# Altium project GIRO_LOGGER.PrjPcb
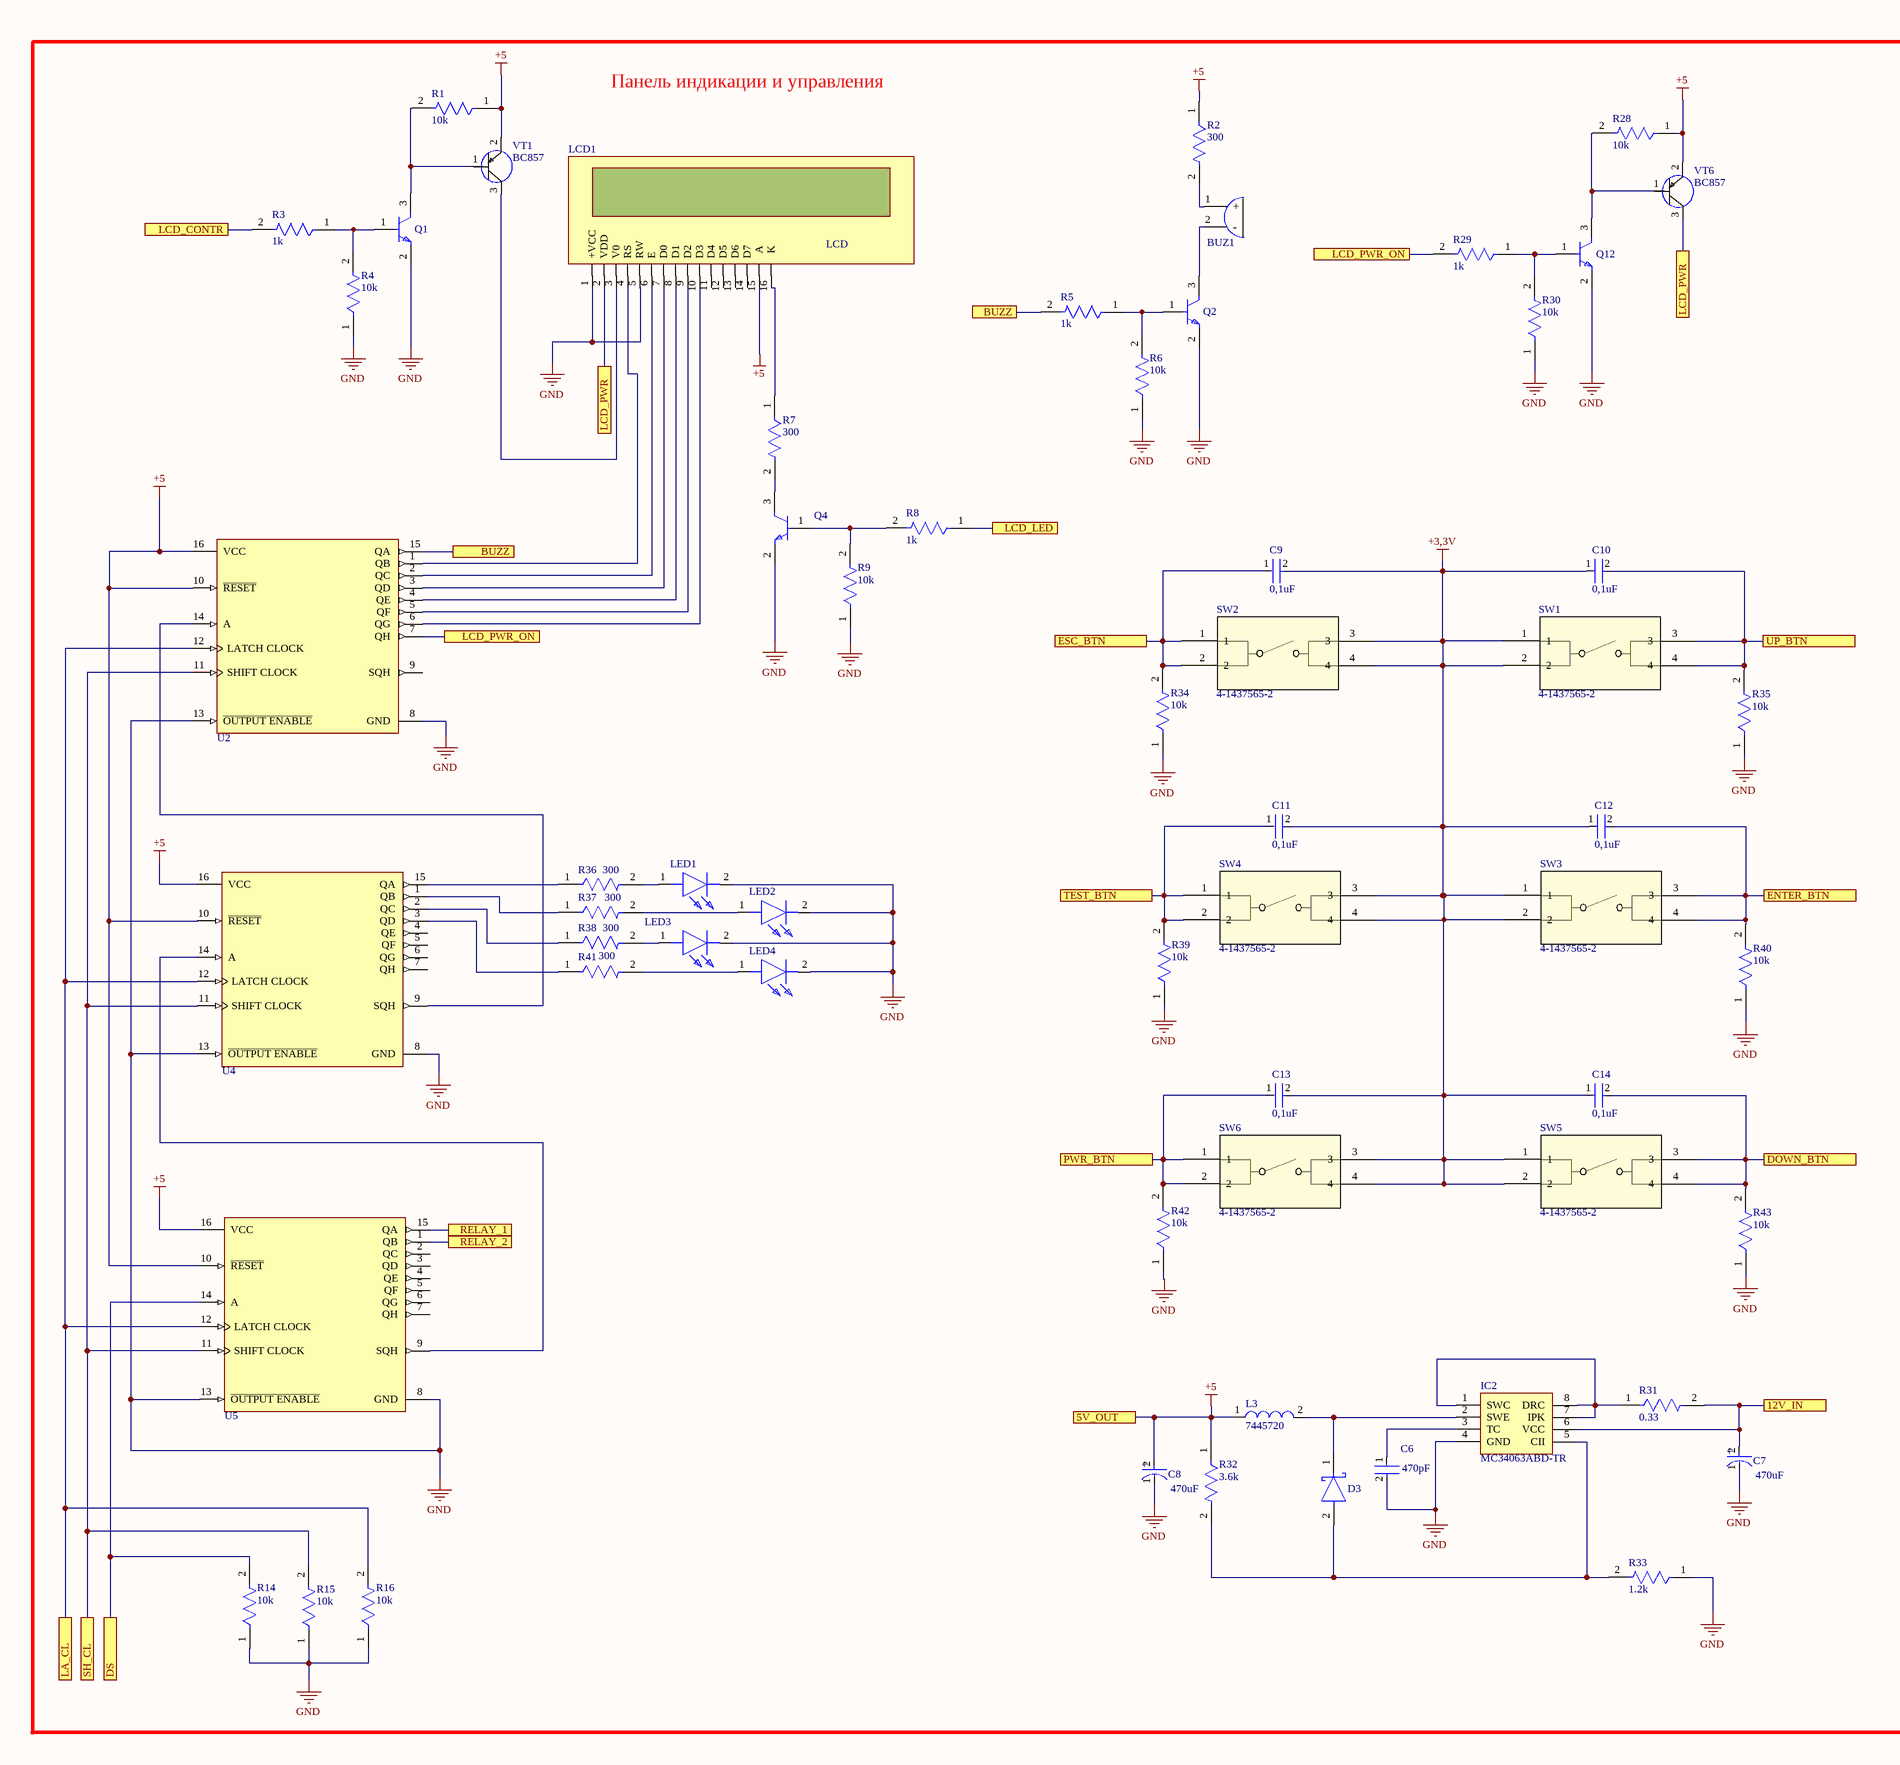
[diagram p0: Logger.SchDoc, left]
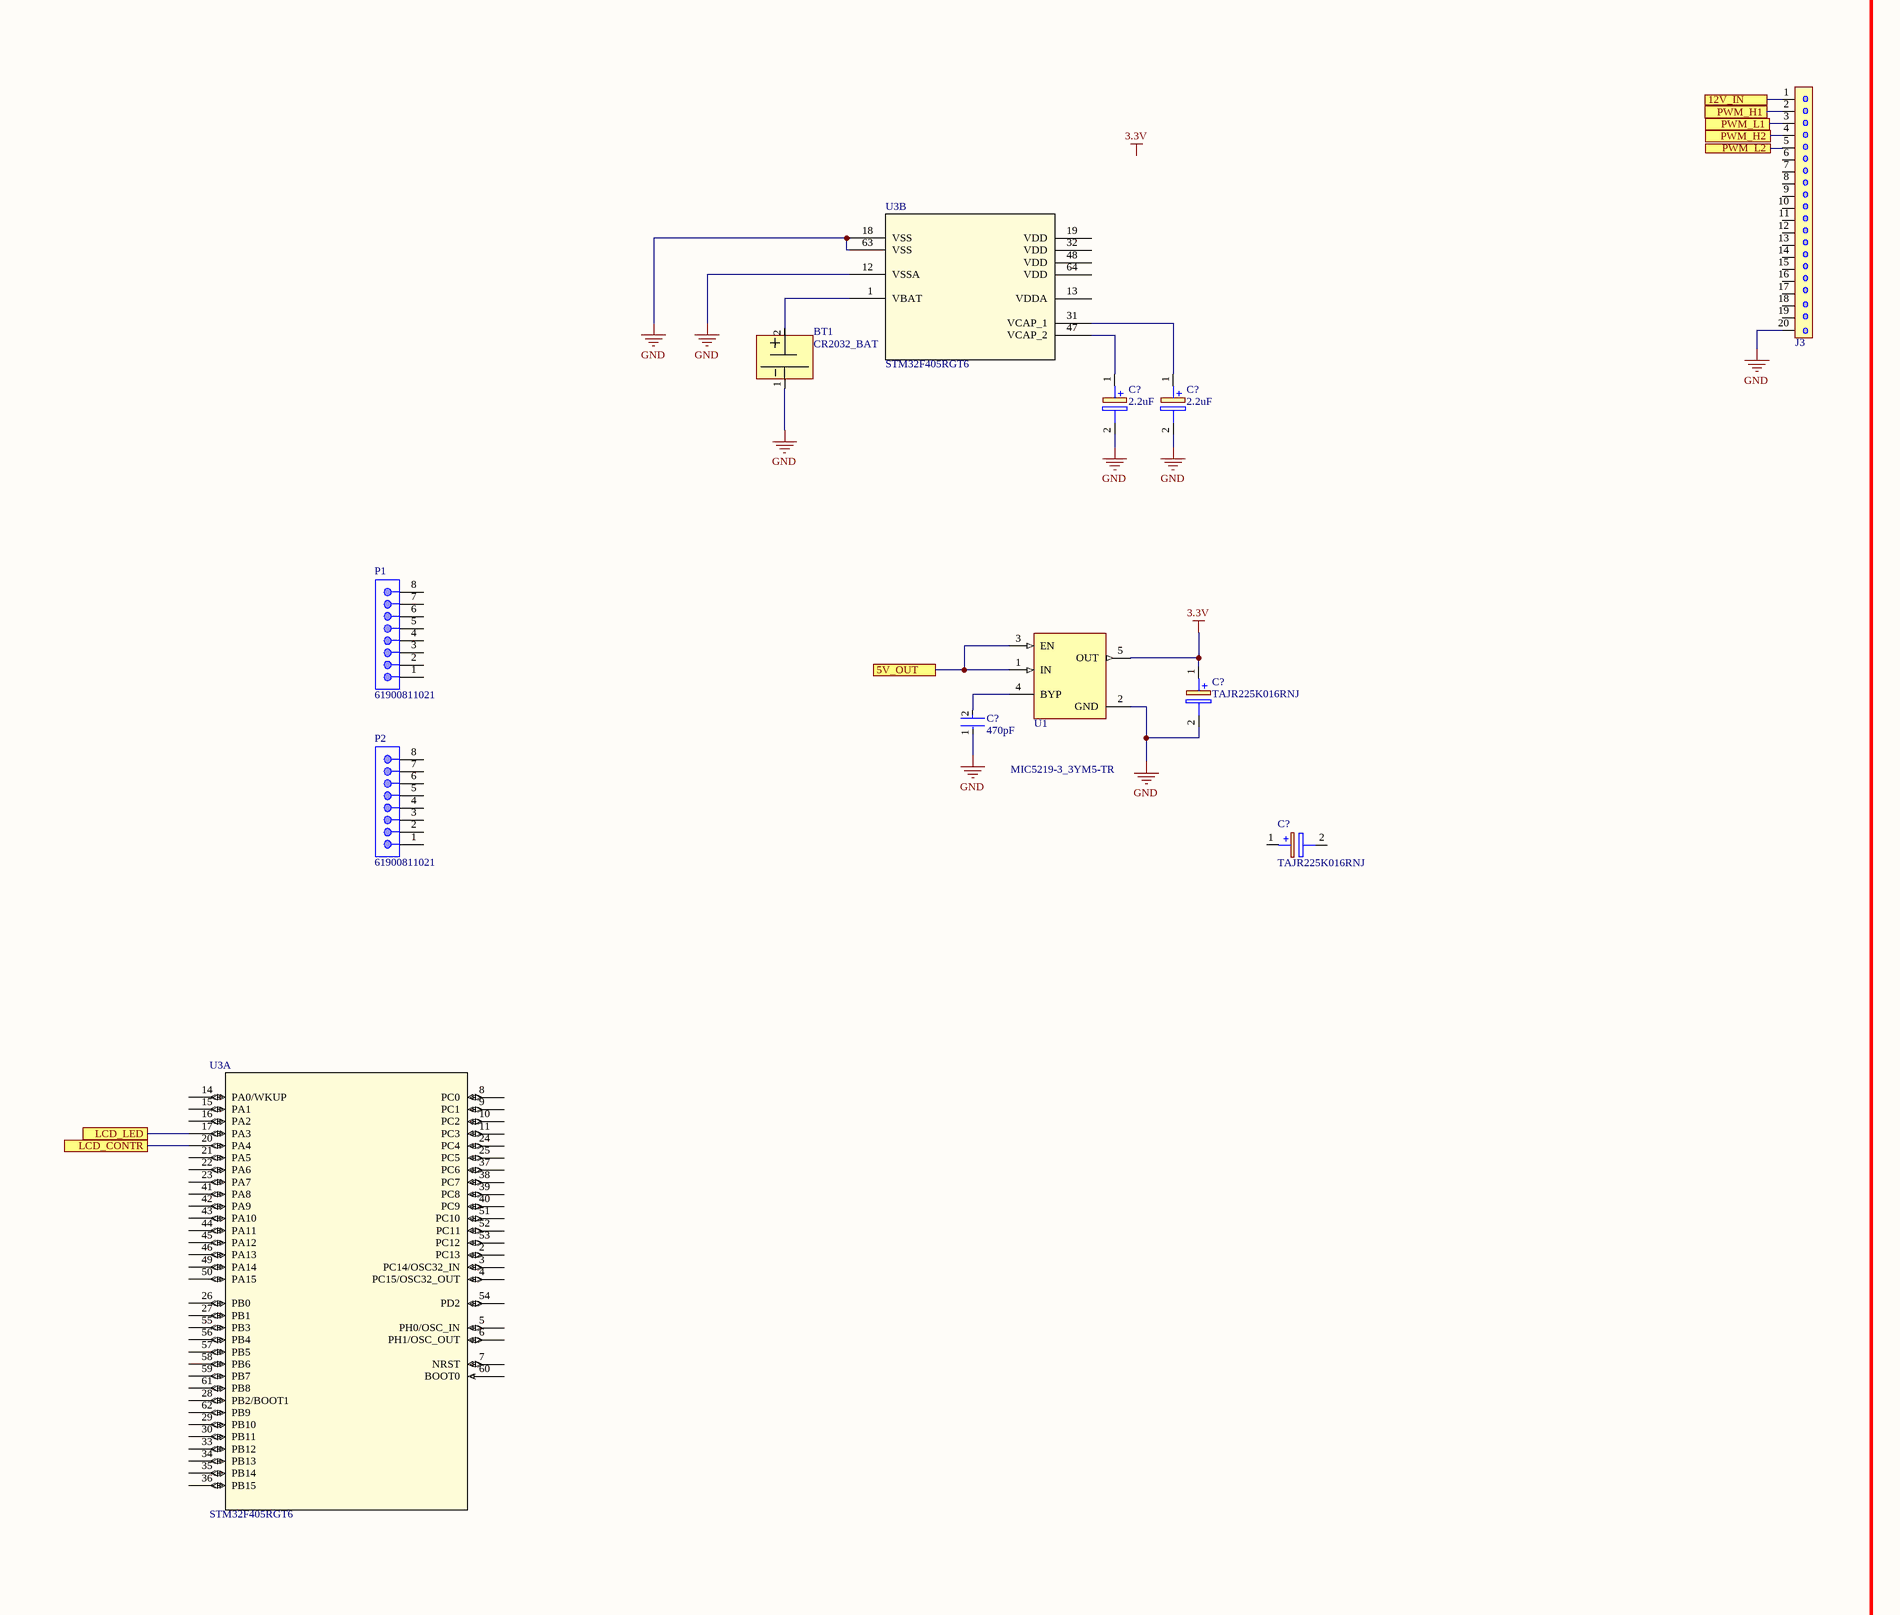
[diagram p1: Logger.SchDoc, right]
4 sheets, 246 parts. Net scope: flat (ports and power ports of the same name join across sheets).
Board files: PCB1.PcbDoc, INVERTER.PcbDoc, Batarey.PcbDoc
Sheets:
  Logger.SchDoc
  Sheet1.SchDoc
  Batarey.SchDoc
  INV.SchDoc

## Sheet Logger.SchDoc
size A1; SheetNumber: 1; SheetTotal: 4

### Parts
(Parts that share a designator on the sheet are numbered #1, #2 ... from top to bottom, then left to right.)
BT1  CR2032_BAT  [CR2032_BAT]
BUZ1  BUZZER  [BUZZER]  (value not drawn)
C6  470pF  [KEMET_C0805C-DN_IPC_C]
C7  470uF  [Nichicon_0_MFG]
C8  470uF  [Nichicon_0_MFG]
C9  0,1uF  [KEMET_C0805C-DN_IPC_C]
C10  0,1uF  [KEMET_C0805C-DN_IPC_C]
C11  0,1uF  [KEMET_C0805C-DN_IPC_C]
C12  0,1uF  [KEMET_C0805C-DN_IPC_C]
C13  0,1uF  [KEMET_C0805C-DN_IPC_C]
C14  0,1uF  [KEMET_C0805C-DN_IPC_C]
C?#1  2.2uF  [CAPPM2014X140N]
C?#2  2.2uF  [CAPPM2014X140N]
C?#3  TAJR225K016RNJ  [CAPPM2014X140N]
C?#4  470pF  [KEMET_C0805C-DN_IPC_C]
C?#5  TAJR225K016RNJ  [CAPPM2014X140N]
D3  Diode_Vishay_SS16-E3-61T_eec  [Vishay_SS16-E3-61T_0]  (value not drawn)
IC2  MC34063ABD-TR  [SOIC127P600X175-8N]
J3  20_pin_connector  [20_pin_connector]  (value not drawn)
L3  7445720  [WE-PD2-L]
LCD1  LCD  [LCD20x4]
LED1  151031YS06000  [151031YS06000]  (value not drawn)
LED2  151031YS06000  [151031YS06000]  (value not drawn)
LED3  151031YS06000  [151031YS06000]  (value not drawn)
LED4  151031YS06000  [151031YS06000]  (value not drawn)
P1  61900811021  [61900811021]
P2  61900811021  [61900811021]
Q1  SBC847BLT1G  [On_Semiconductor_318-08_IPC_B]  (value not drawn)
Q2  SBC847BLT1G  [On_Semiconductor_318-08_IPC_B]  (value not drawn)
Q4  SBC847BLT1G  [On_Semiconductor_318-08_IPC_B]  (value not drawn)
Q12  SBC847BLT1G  [On_Semiconductor_318-08_IPC_B]  (value not drawn)
R1  10k  [Vishay_CRCW0805-e3_IPC_A]
R2  300  [Vishay_CRCW0805-e3_IPC_A]
R3  1k  [Vishay_CRCW0805-e3_IPC_A]
R4  10k  [Vishay_CRCW0805-e3_IPC_A]
R5  1k  [Vishay_CRCW0805-e3_IPC_A]
R6  10k  [Vishay_CRCW0805-e3_IPC_A]
R7  300  [Vishay_CRCW0805-e3_IPC_A]
R8  1k  [Vishay_CRCW0805-e3_IPC_A]
R9  10k  [Vishay_CRCW0805-e3_IPC_A]
R14  10k  [Vishay_CRCW0805-e3_IPC_A]
R15  10k  [Vishay_CRCW0805-e3_IPC_A]
R16  10k  [Vishay_CRCW0805-e3_IPC_A]
R28  10k  [Vishay_CRCW0805-e3_IPC_A]
R29  1k  [Vishay_CRCW0805-e3_IPC_A]
R30  10k  [Vishay_CRCW0805-e3_IPC_A]
R31  0.33  [Vishay_CRCW0805-e3_IPC_A]
R32  3.6k  [Vishay_CRCW0805-e3_IPC_A]
R33  1.2k  [Vishay_CRCW0805-e3_IPC_A]
R34  10k  [Vishay_CRCW0805-e3_IPC_A]
R35  10k  [Vishay_CRCW0805-e3_IPC_A]
R36  300  [Vishay_CRCW0805-e3_IPC_A]
R37  300  [Vishay_CRCW0805-e3_IPC_A]
R38  300  [Vishay_CRCW0805-e3_IPC_A]
R39  10k  [Vishay_CRCW0805-e3_IPC_A]
R40  10k  [Vishay_CRCW0805-e3_IPC_A]
R41  300  [Vishay_CRCW0805-e3_IPC_A]
R42  10k  [Vishay_CRCW0805-e3_IPC_A]
R43  10k  [Vishay_CRCW0805-e3_IPC_A]
SW1  4-1437565-2  [SW4_FSM-5P23_TEC]
SW2  4-1437565-2  [SW4_FSM-5P23_TEC]
SW3  4-1437565-2  [SW4_FSM-5P23_TEC]
SW4  4-1437565-2  [SW4_FSM-5P23_TEC]
SW5  4-1437565-2  [SW4_FSM-5P23_TEC]
SW6  4-1437565-2  [SW4_FSM-5P23_TEC]
U1  MIC5219-3_3YM5-TR  [Microchip_SOT23-5LD-PL-1_MFG]
U2  MC74HC595ADG  [On_Semiconductor_751B-05_MFG]  (value not drawn)
U3  STM32F405RGT6  [LQFP64-10x10mm]  (parts A,B of 2)
U4  MC74HC595ADG  [On_Semiconductor_751B-05_IPC_B]  (value not drawn)
U5  MC74HC595ADG  [On_Semiconductor_751B-05_IPC_B]  (value not drawn)
VT1  BC857  [On_Semiconductor_318-08_IPC_C]
VT6  BC857  [On_Semiconductor_318-08_IPC_C]

### Blocks framed on the sheet
Панель индикации и управления: BT1 BUZ1 C6-C14 C?#1-C?#5 D3 IC2 J3 L3 LCD1 LED1-LED4 P1 P2 Q1 Q2 Q4 Q12 R1-R9 R14-R16 R28-R43 SW1-SW6 U1-U5 VT1 VT6

### Ports
5V_OUT, 12V_IN, BUZZ, DOWN_BTN, DS, ENTER_BTN, ESC_BTN, LA_CL, LCD_CONTR, LCD_LED, LCD_PWR, LCD_PWR_ON, PWM_H1, PWM_H2, PWM_L1, PWM_L2, PWR_BTN, RELAY_1, RELAY_2, SH_CL, TEST_BTN, UP_BTN

### Nets
3.3V: C?#3.1(+) U1.5(OUT)
+3,3V: C9.2 C10.1 C11.2 C12.1 C13.2 C14.1 SW1.1 SW1.2 SW2.3 SW2.4 SW3.1 SW3.2 SW4.3 SW4.4 SW5.1 SW5.2 SW6.3 SW6.4
+5: C8.2(A) L3.1 LCD1.15(A) R1.1 R2.1 R28.1 R32.1 U1.1(IN) U1.3(EN) U2.10(~{RESET}) U2.16(VCC) U4.10(~{RESET}) U4.16(VCC) U5.10(~{RESET}) U5.16(VCC) VT1.2(E) VT6.2(E) ; port 5V_OUT
GND: BT1.1(-) C6.2 C7.1(C) C8.1(C) C?#1.2(-) C?#2.2(-) C?#3.2(-) C?#4.1 IC2.4(GND) J3.20 LCD1.1(+VCC) LCD1.5(RW) LED1.2(K) LED2.2(K) LED3.2(K) LED4.2(K) Q1.2(E) Q2.2(E) Q4.2(E) Q12.2(E) R4.1 R6.1 R9.1 R14.1 R15.1 R16.1 R30.1 R33.1 R34.1 R35.1 R39.1 R40.1 R42.1 R43.1 U1.2(GND) U2.8(GND) U2.13(~{OUTPUT_ENABLE}) U3.12(VSSA) U3.18(VSS) U3.63(VSS) U4.8(GND) U4.13(~{OUTPUT_ENABLE}) U5.8(GND) U5.13(~{OUTPUT_ENABLE})
NetBT1_2: BT1.2(+) U3.1(VBAT)
NetBUZ1_1: BUZ1.1(+) R2.2
NetBUZ1_2: BUZ1.2(-) Q2.3(C)
NetC6_1: C6.1 IC2.3(TC)
NetC7_2: C7.2(A) IC2.6(VCC) J3.1 R31.2 ; port 12V_IN
NetC9_1: C9.1 R34.2 SW2.1 SW2.2 ; port ESC_BTN
NetC10_2: C10.2 R35.2 SW1.3 SW1.4 ; port UP_BTN
NetC11_1: C11.1 R39.2 SW4.1 SW4.2 ; port TEST_BTN
NetC12_2: C12.2 R40.2 SW3.3 SW3.4 ; port ENTER_BTN
NetC13_1: C13.1 R42.2 SW6.1 SW6.2 ; port PWR_BTN
NetC14_2: C14.2 R43.2 SW5.3 SW5.4 ; port DOWN_BTN
NetC?#1_1: C?#1.1(+) U3.47(VCAP_2)
NetC?#2_1: C?#2.1(+) U3.31(VCAP_1)
NetC?#4_2: C?#4.2 U1.4(BYP)
NetD3_1: D3.1(C) IC2.2(SWE) L3.2
NetD3_2: D3.2(A) IC2.5(CII) R32.2 R33.2
NetIC2_1: IC2.1(SWC) IC2.7(IPK) IC2.8(DRC) R31.1
NetJ3_2: J3.2 ; port PWM_H1
NetJ3_3: J3.3 ; port PWM_L1
NetJ3_4: J3.4 ; port PWM_H2
NetJ3_5: J3.5 ; port PWM_L2
NetLCD1_2: LCD1.2(VDD) VT6.3(C) ; port LCD_PWR
NetLCD1_3: LCD1.3(V0) VT1.3(C)
NetLCD1_4: LCD1.4(RS) U2.1(QB)
NetLCD1_6: LCD1.6(E) U2.2(QC)
NetLCD1_7: LCD1.7(D0) U2.3(QD)
NetLCD1_8: LCD1.8(D1) U2.4(QE)
NetLCD1_9: LCD1.9(D2) U2.5(QF)
NetLCD1_10: LCD1.10(D3) U2.6(QG)
NetLCD1_16: LCD1.16(K) R7.1
NetLED1_1: LED1.1(A) R36.2
NetLED2_1: LED2.1(A) R37.2
NetLED3_1: LED3.1(A) R38.2
NetLED4_1: LED4.1(A) R41.2
NetQ1_1: Q1.1(B) R3.1 R4.2
NetQ1_3: Q1.3(C) R1.2 VT1.1(B)
NetQ2_1: Q2.1(B) R5.1 R6.2
NetQ4_1: Q4.1(B) R8.2 R9.2
NetQ4_3: Q4.3(C) R7.2
NetQ12_1: Q12.1(B) R29.1 R30.2
NetQ12_3: Q12.3(C) R28.2 VT6.1(B)
NetR3_2: R3.2 U3.20(PA4) ; port LCD_CONTR
NetR5_2: R5.2 U2.15(QA) ; port BUZZ
NetR8_1: R8.1 U3.17(PA3) ; port LCD_LED
NetR14_2: R14.2 U5.14(A) ; port DS
NetR15_2: R15.2 U2.11(SHIFT_CLOCK) U4.11(SHIFT_CLOCK) U5.11(SHIFT_CLOCK) ; port SH_CL
NetR16_2: R16.2 U2.12(LATCH_CLOCK) U4.12(LATCH_CLOCK) U5.12(LATCH_CLOCK) ; port LA_CL
NetR29_2: R29.2 U2.7(QH) ; port LCD_PWR_ON
NetR36_1: R36.1 U4.15(QA)
NetR37_1: R37.1 U4.1(QB)
NetR38_1: R38.1 U4.2(QC)
NetR41_1: R41.1 U4.3(QD)
NetU2_14: U2.14(A) U4.9(SQH)
NetU4_14: U4.14(A) U5.9(SQH)
NetU5_1: U5.1(QB) ; port RELAY_2
NetU5_15: U5.15(QA) ; port RELAY_1

Not connected (* = marked no-connect by the designer): C?#5 1(+) 2(-); J3 6 7 8 9 10 11 12 13 14 15 16 17 18 19; LCD1 11(D4) 12(D5) 13(D6) 14(D7); P1 1 2 3 4 5 6 7 8; P2 1 2 3 4 5 6 7 8; U2 9(SQH); U3 2(PC13) 3(PC14/OSC32_IN) 4(PC15/OSC32_OUT) 5(PH0/OSC_IN) 6(PH1/OSC_OUT) 7(NRST) 8(PC0) 9(PC1) 10(PC2) 11(PC3) 13(VDDA) 14(PA0/WKUP) 15(PA1) 16(PA2) 19(VDD) 21(PA5) 22(PA6) 23(PA7) 24(PC4) 25(PC5) 26(PB0) 27(PB1) 28(PB2/BOOT1) 29(PB10) 30(PB11) 32(VDD) 33(PB12) 34(PB13) 35(PB14) 36(PB15) 37(PC6) 38(PC7) 39(PC8) 40(PC9) 41(PA8) 42(PA9) 43(PA10) 44(PA11) 45(PA12) 46(PA13) 48(VDD) 49(PA14) 50(PA15) 51(PC10) 52(PC11) 53(PC12) 54(PD2) 55(PB3) 56(PB4) 57(PB5) 58(PB6) 59(PB7) 60(BOOT0) 61(PB8) 62(PB9) 64(VDD); U4 4(QE) 5(QF) 6(QG) 7(QH); U5 2(QC) 3(QD) 4(QE) 5(QF) 6(QG) 7(QH)

### Notes on the sheet
- Labels drawn without touching a wire or pin: 3.3V
- (in symbol UWX1E101MCL1GB) +

### Library data of the parts
C6 C9-C14 C?#4 = C0805C104J4RACTU
C7 C8 = UWX1E101MCL1GB
C?#1-C?#3 C?#5 = TAJR225K016RNJ: Capacitor Polarised; Manufacturer_Name: AVX; Datasheet Link: http://www.farnell.com/datasheets/1680476.pdf; Height: 1.2mm; Manufacturer_Part_Number: TAJR225K016RNJ; Mouser Part Number: 581-TAJR225K016RNJ; Mouser Price/Stock: https://www.mouser.co.uk/ProductDetail/AVX/TAJR225K016RNJ/?qs=vQJa%252BfcOt8MJtnsQ1zkKAg%3D%3D; Arrow Part Number: TAJR225K016RNJ; Arrow Price/Stock: https://www.arrow.com/en/products/tajr225k016rnj/avx
D3 = Diode_Vishay_SS16-E3-61T_eec: Diode Schottky 60V 1A Surface Mount DO-214AC (SMA); Part Number: SS16-E3/61T; Manufacturer: Vishay; Voltage - Forward (Vf) (Max) @ If: 750mV @ 1A; Current - Reverse Leakage @ Vr: 200µA @ 60V; helpURL: https://upverter.com/upn/revision/46fb9ccadf7e3052/; ComponentLink2Description: Datasheet; Temperature: -65°C to +150°C; Package: DO-214AC; Supplier 2: Mouser; Price: 0.180579591464; Supplier 1: Digi-Key; ComponentLink1URL: https://upverter.com/upn/revision/46fb9ccadf7e3052/; Supplier Part Number 2: 625-SS16-E3; Supplier Part Number 1: SS16-E3/61TGICT-ND; ComponentLink1Description: Upverter; ComponentLink2URL: http://www.vishay.com/docs/88746/ss12.pdf; RoHS: TRUE; Mouser Part Number: 625-SS16-E3; Temperature Range High: +150°C; Digikey Description: Diode Schottky 60V 1A Surface Mount DO-214AC (SMA); Digikey Part Number: SS16-E3/61TGICT-ND; Current - Average Rectified (Io): 1A; Lead Free: yes; Voltage - DC Reverse (Vr) (Max): 60V; Temperature Range Low: -65°C
IC2 = MC34063ABD-TR: Integrated Circuit; Manufacturer_Name: STMicroelectronics; Datasheet Link: http://www.st.com/st-web-ui/static/active/en/resource/technical/document/datasheet/CD00001232.pdf; Height: 1.75mm; Manufacturer_Part_Number: MC34063ABD-TR; Mouser Part Number: 511-MC34063ABD-TR; Mouser Price/Stock: https://www.mouser.co.uk/ProductDetail/STMicroelectronics/MC34063ABD-TR?qs=PGXP4M47uW4YbbaNPuFQGA%3D%3D; Arrow Part Number: MC34063ABD-TR; Arrow Price/Stock: https://www.arrow.com/en/products/mc34063abd-tr/stmicroelectronics?region=nac
J3 = 20_pin_connector: 20_pin 2.54mm connector
L3 = 7445720: SMD-Power Inductor WE-PD4, L = 100 µH; Inductance: 100 ÂµH; ComponentLink1Description: Manufacturer Link; ComponentLink2Description: Datasheet; DatasheetVersion: ver 1, Oct-2004; ComponentLink1URL: http://www.we-online.com; PackageVersion: 2004; PackageDescription: SMD Inductor, 2-Leads, Body 22.0 x 15.0 mm; ComponentLink2URL: http://www.we-online.de/katalog/media/pdf/7445720.pdf; PackageReference: WE-PD4-XL; PartNumber: 7445720
LCD1 = LCD: 20x4
LED1-LED4 = 151031YS06000: LED; Manufacturer_Name: Wurth Elektronik; Datasheet Link: https://katalog.we-online.de/led/datasheet/151031YS06000.pdf; Height: 5.5mm; Manufacturer_Part_Number: 151031YS06000; Mouser Part Number: 710-151031YS06000; Mouser Price/Stock: https://www.mouser.co.uk/ProductDetail/Wurth-Elektronik/151031YS06000?qs=LlUlMxKIyB3xSYYW%252BcuBiQ%3D%3D
P1 P2 = 61900811021: WR-WTB THT Male Left Angled Bottom Locking Header, pitch 2.54mm, 8p; Pin Number: 8; Contact Resistance: 20mOhm; Rated Current: 3A; Withstanding Voltage: 1000VAC; Working Voltage: 250VAC; ComponentLink1Description: Manufacturer; ComponentLink1URL: http://www.we-online.de; ComponentLink2Description: Datasheet; ComponentLink2URL: https://www.we-online.com/catalog/datasheet/61900811021.pdf; Pitch: 2.54mm; Published Date: January 2020; Publisher: Wurth Elektronik; Mounting Technology: THT; Packaging: Bag; Operating Temperature: -40 to +105degC; Part Number: 61900811021; Gender: Male; Type: Right Angled Bottom Locking
R1-R9 R14-R16 R28-R43 = CRCW08050000Z0EA: 100k: *
SW1-SW6 = 4-1437565-2: No Description Available; Mfr_Name: TE Connectivity; Copyright: Copyright (C) 2022 Ultra Librarian. All rights reserved.; Manufacturer_Part_Number: 4-1437565-2; RefDes: RefDes; Type: DEV
U3 = STM32F405RGT6: No Description Available; Mfr_Name: STMicroelectronics; Copyright: Copyright (C) 2022 Ultra Librarian. All rights reserved.; Manufacturer_Part_Number: STM32F405RGT6; RefDes: RefDes; Type: DEV

## Sheet Sheet1.SchDoc
size A0; SheetNumber: 3; SheetTotal: 4
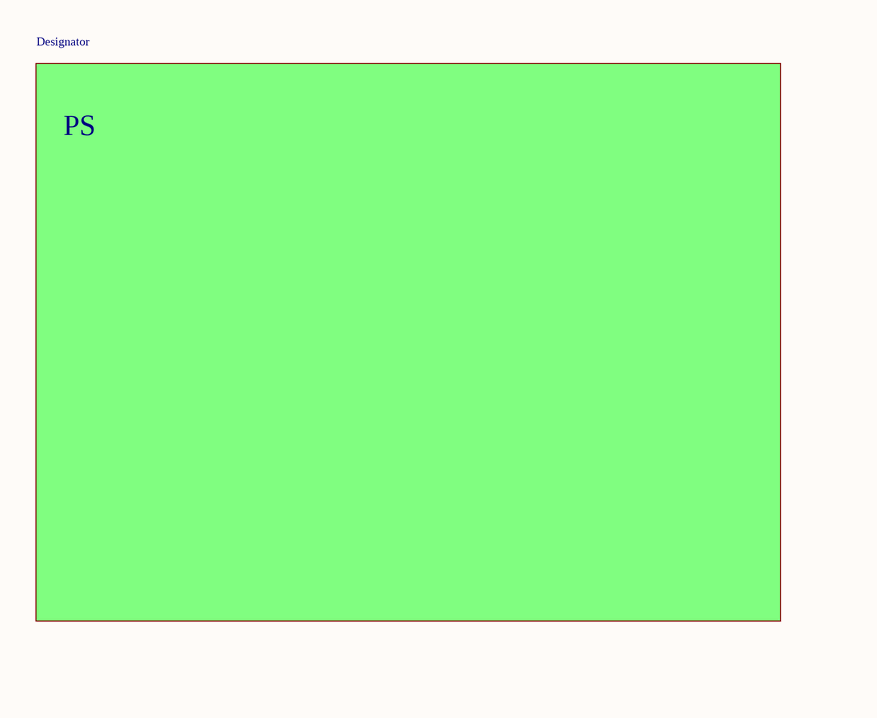
[diagram p2: Sheet1.SchDoc, left]
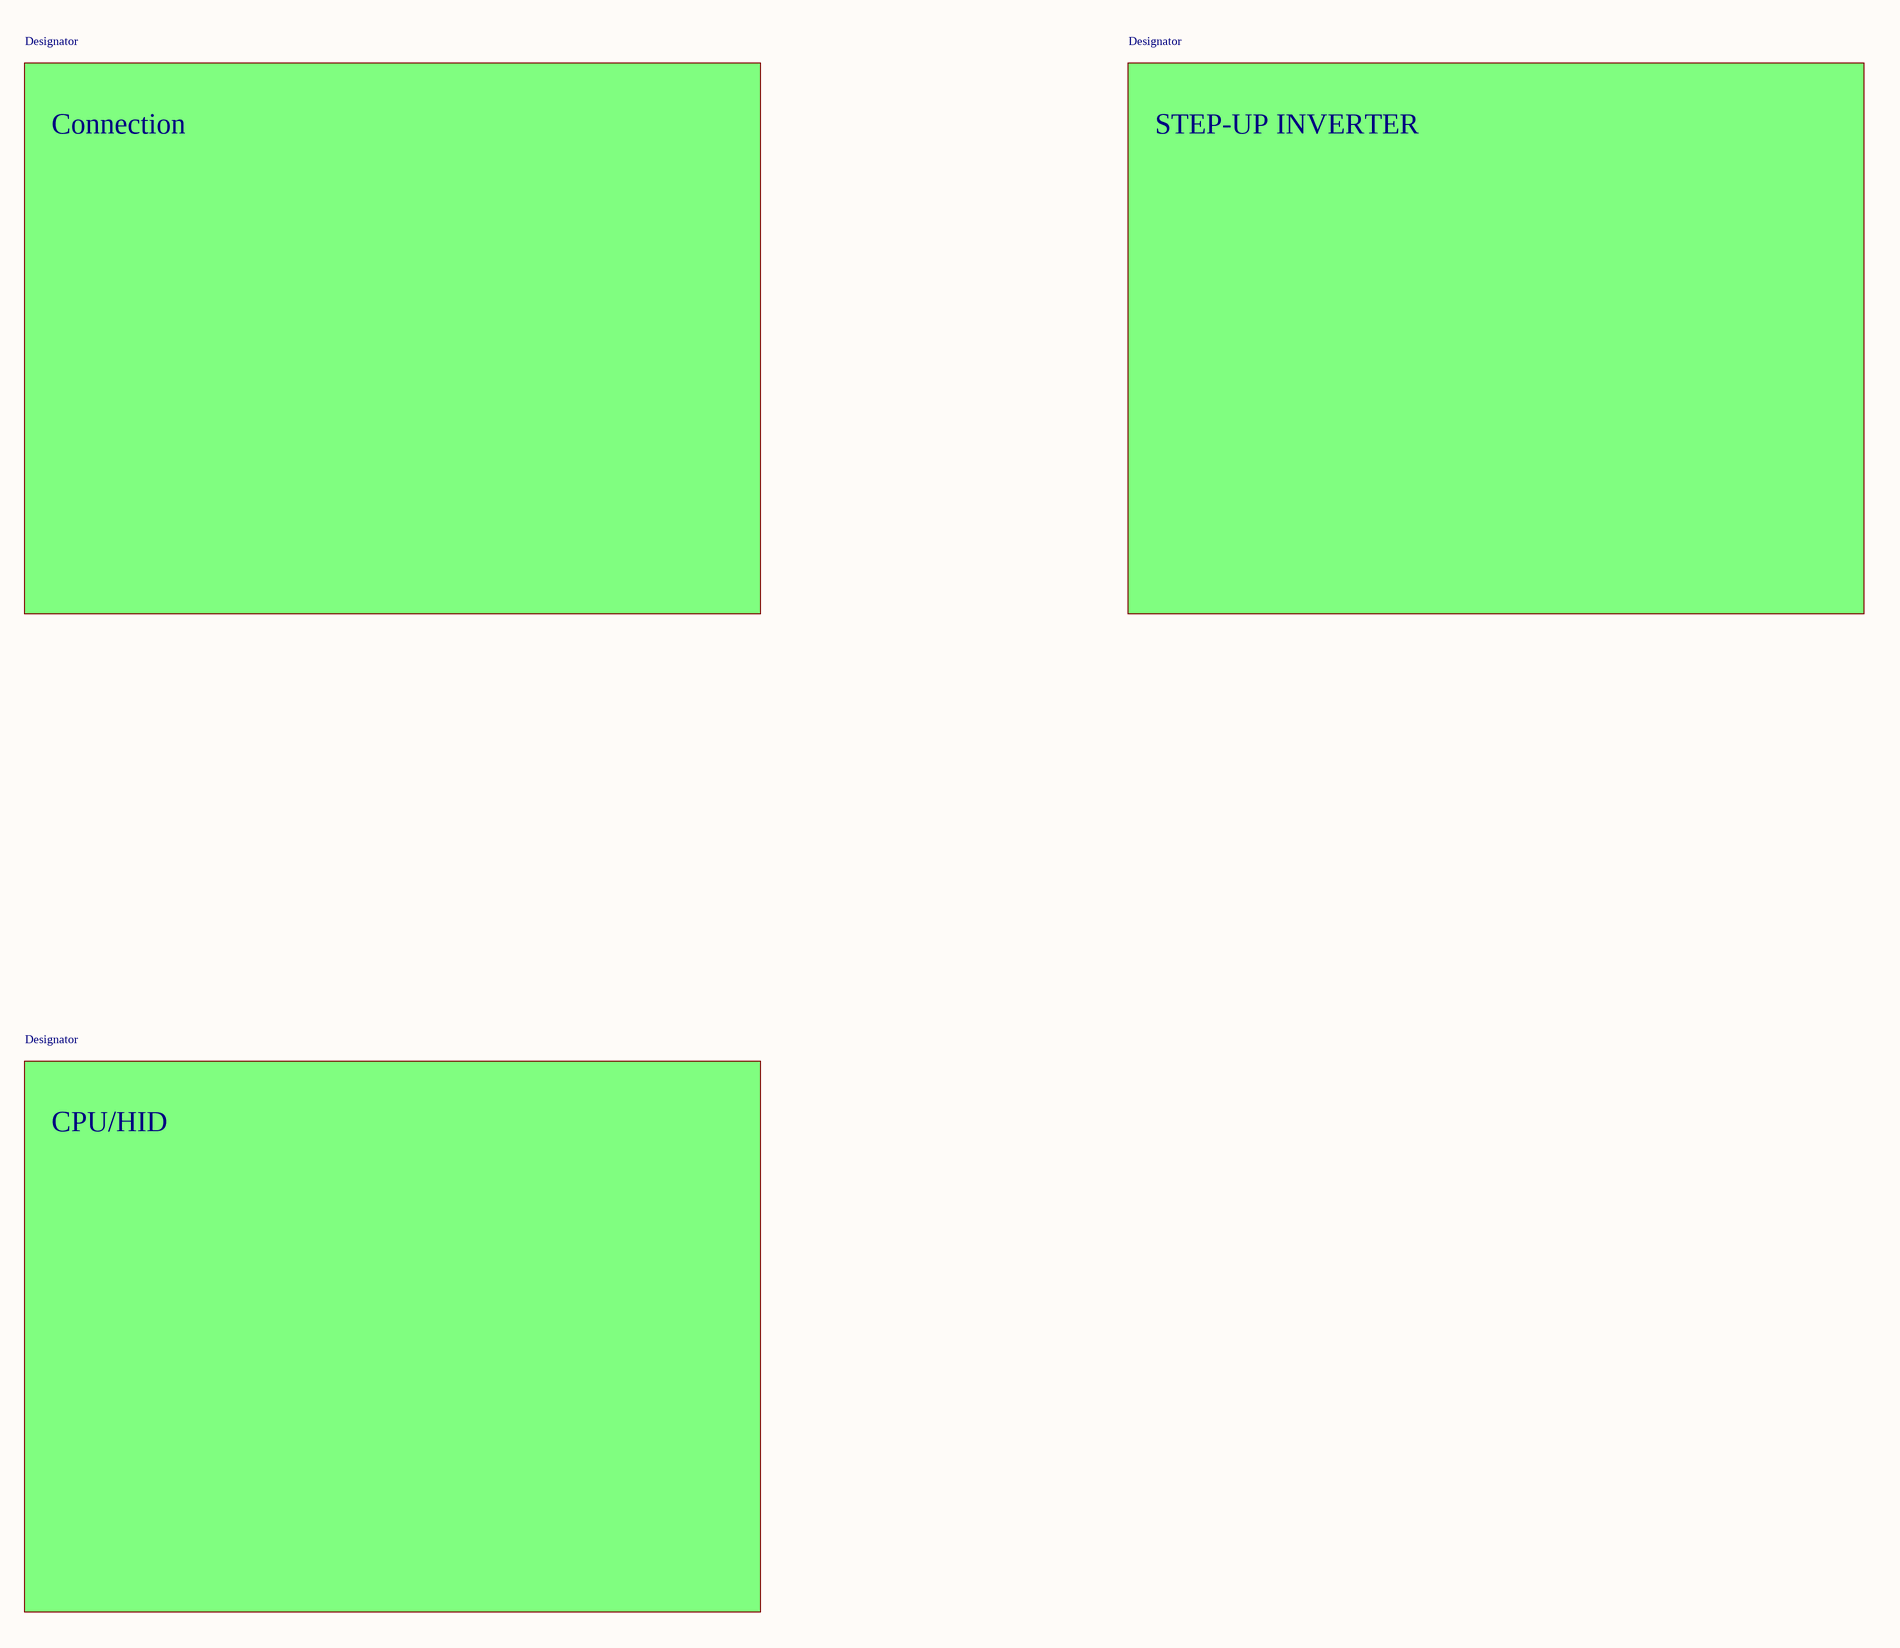
[diagram p3: Sheet1.SchDoc, right]

### Sub-sheets
Designator = PS (file not in this document): no entries
Designator = Connection (file not in this document): no entries
Designator = STEP-UP INVERTER (file not in this document): no entries
Designator = CPU/HID (file not in this document): no entries

## Sheet Batarey.SchDoc
size A1; SheetNumber: 4; SheetTotal: 5
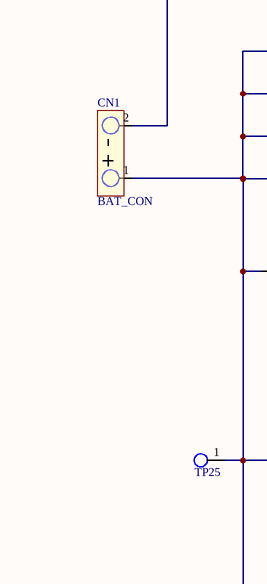
[diagram p4: Batarey.SchDoc, top left]
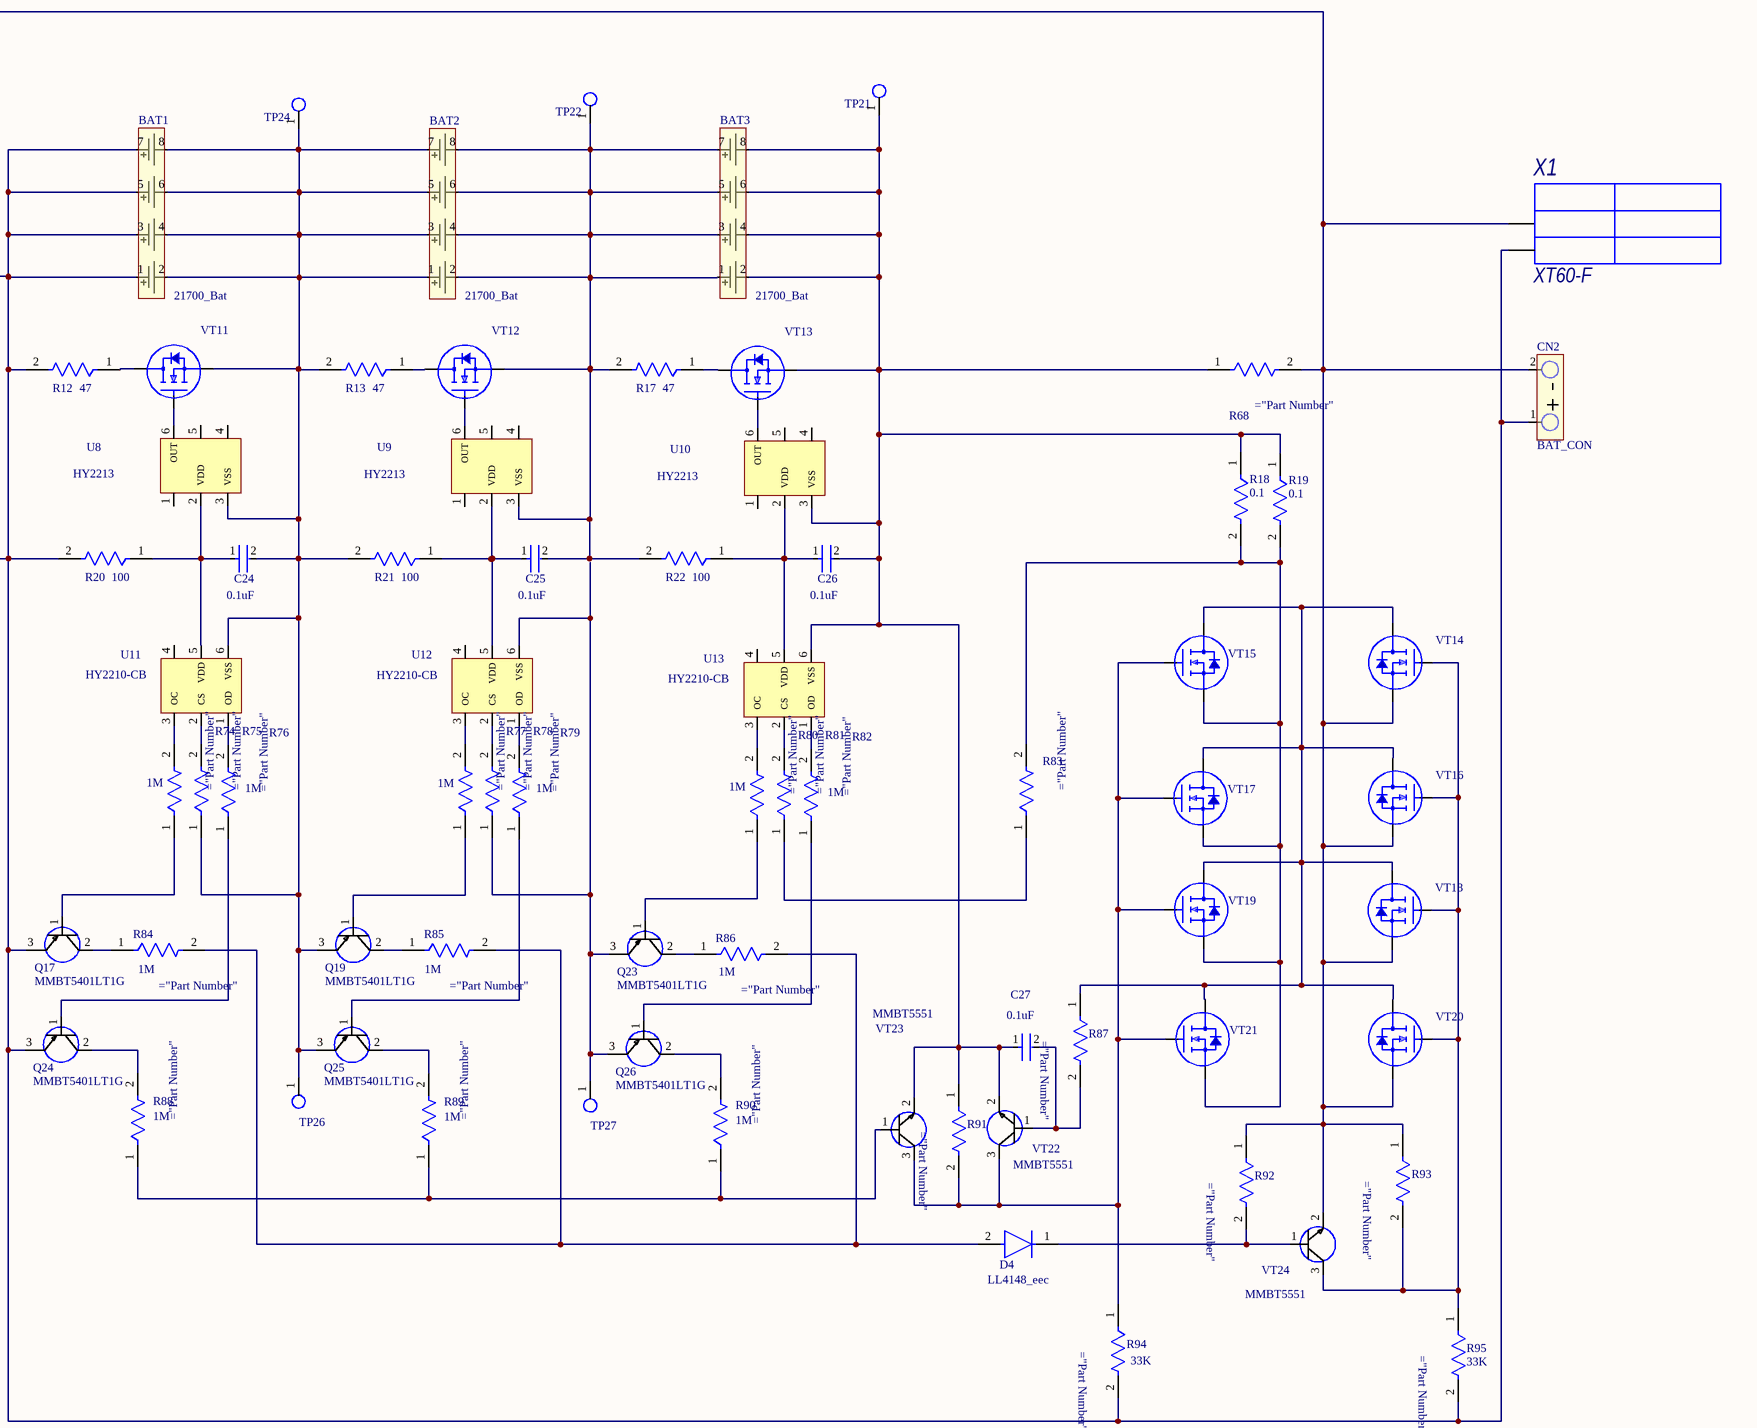
[diagram p5: Batarey.SchDoc, top right]
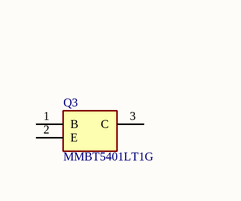
[diagram p6: Batarey.SchDoc, bottom left]

### Parts
BAT1  21700_Bat  [21700_BAT]
BAT2  21700_Bat  [21700_BAT]
BAT3  21700_Bat  [21700_BAT]
C24  0.1uF  [KEMET_C0805C-DN_IPC_A]
C25  0.1uF  [KEMET_C0805C-DN_IPC_A]
C26  0.1uF  [KEMET_C0805C-DN_IPC_A]
C27  0.1uF  [KEMET_C0805C-DN_IPC_A]
CN1  BAT_CON  [Batarey_connector]
CN2  BAT_CON  [Batarey_connector]
D4  LL4148_eec  [Fairchild-ON_Semiconductor_LL4148_0]
Q3  MMBT5401LT1G  [SOT96P237X111-3N]
Q17  MMBT5401LT1G  [SOT96P237X111-3N]
Q19  MMBT5401LT1G  [SOT96P237X111-3N]
Q23  MMBT5401LT1G  [SOT96P237X111-3N]
Q24  MMBT5401LT1G  [SOT96P237X111-3N]
Q25  MMBT5401LT1G  [SOT96P237X111-3N]
Q26  MMBT5401LT1G  [SOT96P237X111-3N]
R12  47  [TE_Connectivity_CRGCQ1210_IPC_A]
R13  47  [TE_Connectivity_CRGCQ1210_IPC_A]
R17  47  [TE_Connectivity_CRGCQ1210_IPC_A]
R18  0.1  [TE_Connectivity_CRGCQ1210_IPC_A]
R19  0.1  [TE_Connectivity_CRGCQ1210_IPC_A]
R20  100  [Vishay_CRCW0805-e3_IPC_A]
R21  100  [Vishay_CRCW0805-e3_IPC_A]
R22  100  [Vishay_CRCW0805-e3_IPC_A]
R68  RC0805FR-07100KL  [Vishay_CRCW0805-e3_IPC_A]  (value not drawn)
R74  1M  [Vishay_CRCW0805-e3_IPC_A]
R75  RC0805FR-07100KL  [Vishay_CRCW0805-e3_IPC_A]  (value not drawn)
R76  1M  [Vishay_CRCW0805-e3_IPC_A]
R77  1M  [Vishay_CRCW0805-e3_IPC_A]
R78  RC0805FR-07100KL  [Vishay_CRCW0805-e3_IPC_A]  (value not drawn)
R79  1M  [Vishay_CRCW0805-e3_IPC_A]
R80  1M  [Vishay_CRCW0805-e3_IPC_A]
R81  RC0805FR-07100KL  [Vishay_CRCW0805-e3_IPC_A]  (value not drawn)
R82  1M  [Vishay_CRCW0805-e3_IPC_A]
R83  RC0805FR-07100KL  [Vishay_CRCW0805-e3_IPC_A]  (value not drawn)
R84  1M  [Vishay_CRCW0805-e3_IPC_A]
R85  1M  [Vishay_CRCW0805-e3_IPC_A]
R86  1M  [Vishay_CRCW0805-e3_IPC_A]
R87  RC0805FR-07100KL  [Vishay_CRCW0805-e3_IPC_A]  (value not drawn)
R88  1M  [Vishay_CRCW0805-e3_IPC_A]
R89  1M  [Vishay_CRCW0805-e3_IPC_A]
R90  1M  [Vishay_CRCW0805-e3_IPC_A]
R91  RC0805FR-07100KL  [Vishay_CRCW0805-e3_IPC_A]  (value not drawn)
R92  RC0805FR-07100KL  [Vishay_CRCW0805-e3_IPC_A]  (value not drawn)
R93  RC0805FR-07100KL  [Vishay_CRCW0805-e3_IPC_A]  (value not drawn)
R94  33K  [Vishay_CRCW0805-e3_IPC_A]
R95  33K  [Vishay_CRCW0805-e3_IPC_A]
TP21  Test_Point_PCB  [TEST_POINT_CONN]  (value not drawn)
TP22  Test_Point_PCB  [TEST_POINT_CONN]  (value not drawn)
TP24  Test_Point_PCB  [TEST_POINT_CONN]  (value not drawn)
TP25  Test_Point_PCB  [TEST_POINT_CONN]  (value not drawn)
TP26  Test_Point_PCB  [TEST_POINT_CONN]  (value not drawn)
TP27  Test_Point_PCB  [TEST_POINT_CONN]  (value not drawn)
U8  HY2213  [HY2213]
U9  HY2213  [HY2213]
U10  HY2213  [HY2213]
U11  HY2210-CB  [HY2213]
U12  HY2210-CB  [HY2213]
U13  HY2210-CB  [HY2213]
VT11  IPB60R600P6  [TO-263-3]  (value not drawn)
VT12  IPB60R600P6  [TO-263-3]  (value not drawn)
VT13  IPB60R600P6  [TO-263-3]  (value not drawn)
VT14  IPB60R600P6  [TO-263-3]  (value not drawn)
VT15  IPB60R600P6  [TO-263-3]  (value not drawn)
VT16  IPB60R600P6  [TO-263-3]  (value not drawn)
VT17  IPB60R600P6  [TO-263-3]  (value not drawn)
VT18  IPB60R600P6  [TO-263-3]  (value not drawn)
VT19  IPB60R600P6  [TO-263-3]  (value not drawn)
VT20  IPB60R600P6  [TO-263-3]  (value not drawn)
VT21  IPB60R600P6  [TO-263-3]  (value not drawn)
VT22  MMBT5551  [BC847B215]
VT23  MMBT5551  [BC847B215]
VT24  MMBT5551  [BC847B215]
X1  XT60-F  [XT60-F AMASS]

### Nets
NetBAT1_1: BAT1.1(+1S) BAT1.3(+2S) BAT1.5(+3S) BAT1.7(+4S) CN1.1(+) CN2.1(+) Q17.3(E) Q24.3(E) R12.2 R20.2 R94.2 R95.2 TP25.1(G9) X1.2
NetBAT1_4: BAT1.4(-2S) BAT1.6(-3S) BAT2.1(+1S) BAT2.3(+2S) BAT2.5(+3S) BAT2.7(+4S) C24.2 Q19.3(E) Q25.3(E) R21.2 R75.1 TP26.1(G9) U8.3(VSS) U11.6(VSS) VT11.S
NetBAT1_8: BAT1.8(-4S) TP24.1(G9)
NetBAT2_2: BAT2.2(-1S) BAT2.4(-2S) BAT2.6(-3S) BAT2.8(-4S) BAT3.1(+1S) BAT3.3(+2S) BAT3.5(+3S) BAT3.7(+4S) C25.2 R17.2 R22.2 TP22.1(G9) U9.3(VSS) VT12.S
NetBAT3_2: BAT3.2(-1S) BAT3.4(-2S) BAT3.6(-3S) BAT3.8(-4S) C26.2 C27.1 R18.1 R19.1 R68.1 R91.1 TP21.1(G9) U10.3(VSS) U13.6(VSS) VT13.S VT22.2(E) VT23.2(E)
NetC24_1: C24.1 R20.1 U8.2(VDD) U11.5(VDD)
NetC25_1: C25.1 R21.1 U9.2(VDD) U12.5(VDD)
NetC26_1: C26.1 R22.1 U10.2(VDD) U13.5(VDD)
NetC27_2: C27.2 R87.2 VT22.1(B)
NetCN1_2: CN1.2(-) CN2.2(-) R68.2 R92.1 R93.1 VT14.S VT16.S VT18.S VT20.S VT24.2(E) X1.1
NetD4_1: D4.1(C) R92.2 VT24.1(B)
NetD4_2: D4.2(A) R84.2 R85.2 R86.2
NetQ17_1: Q17.1(B) R74.1
NetQ17_2: Q17.2(C) R84.1
NetQ19_1: Q19.1(B) R77.1
NetQ19_2: Q19.2(C) R85.1
NetQ23_1: Q23.1(B) R80.1
NetQ23_2: Q23.2(C) R86.1
NetQ23_3: Q23.3(E) Q26.3(E) R78.1 TP27.1(G9) U12.6(VSS)
NetQ24_1: Q24.1(B) R76.1
NetQ24_2: Q24.2(C) R88.2
NetQ25_1: Q25.1(B) R79.1
NetQ25_2: Q25.2(C) R89.2
NetQ26_1: Q26.1(B) R82.1
NetQ26_2: Q26.2(C) R90.2
NetR12_1: R12.1 VT11.D
NetR13_1: R13.1 VT12.D
NetR17_1: R17.1 VT13.D
NetR18_2: R18.2 R19.2 R83.2 VT15.S VT17.S VT19.S VT21.S
NetR74_2: R74.2 U11.3(OC)
NetR75_2: R75.2 U11.2(CS)
NetR76_2: R76.2 U11.1(OD)
NetR77_2: R77.2 U12.3(OC)
NetR78_2: R78.2 U12.2(CS)
NetR79_2: R79.2 U12.1(OD)
NetR80_2: R80.2 U13.3(OC)
NetR81_1: R81.1 R83.1
NetR81_2: R81.2 U13.2(CS)
NetR82_2: R82.2 U13.1(OD)
NetR87_1: R87.1 VT14.D VT15.D VT16.D VT17.D VT18.D VT19.D VT20.D VT21.D
NetR88_1: R88.1 R89.1 R90.1 VT23.1(B)
NetR91_2: R91.2 R94.1 VT15.G VT17.G VT19.G VT21.G VT22.3(C) VT23.3(C)
NetR93_2: R93.2 R95.1 VT14.G VT16.G VT18.G VT20.G VT24.3(C)
NetU8_6: U8.6(OUT) VT11.G
NetU9_6: U9.6(OUT) VT12.G
NetU10_6: U10.6(OUT) VT13.G

Not connected (* = marked no-connect by the designer): BAT1 2(-1S); Q3 1(B) 2(E) 3(C); R13 2; U8 1(47) 4 5; U9 1(47) 4 5; U10 1(47) 4 5; U11 4; U12 4; U13 4

### Library data of the parts
C24-C27 = C0805C224K5RACTU
CN1 CN2 = BAT_CON: Batarey_connection
D4 = Diode_Fairchild-ON_Semiconductor_LL4148_eec: DIODE GEN PURP 100V 200MA SOD80; Part Number: LL4148; Manufacturer: Fairchild/ON Semiconductor; Num Pins: 2; helpURL: https://upverter.com/upn/revision/7267ed481d20a817/; ComponentLink2Description: Datasheet; Temperature: -55°C to +175°C; Package: SOD80; Supplier 2: Mouser; Price: 0.0408687939508; Supplier 1: Digi-Key; ComponentLink1URL: https://upverter.com/upn/revision/7267ed481d20a817/; Supplier Part Number 2: 512-LL4148; Supplier Part Number 1: LL4148FSCT-ND; ComponentLink1Description: Upverter; ComponentLink2URL: https://www.fairchildsemi.com/datasheets/LL/LL4148.pdf; RoHS: TRUE; Mouser Part Number: 512-LL4148; Temperature Range High: +175°C; Digikey Description: DIODE GEN PURP 100V 200MA SOD80; Digikey Part Number: LL4148FSCT-ND; Lead Free: yes; Temperature Range Low: -55°C
Q3 = MMBT5401LT1G: Transistor; Manufacturer_Name: onsemi; Datasheet Link: http://www.onsemi.com/pub/Collateral/MMBT5401LT1-D.PDF; Height: 1.11mm; Manufacturer_Part_Number: MMBT5401LT1G; Mouser Part Number: 863-MMBT5401LT1G; Mouser Price/Stock: https://www.mouser.co.uk/ProductDetail/onsemi/MMBT5401LT1G?qs=R2UZ7gjkEjK19vIt05hkDw%3D%3D; Arrow Part Number: MMBT5401LT1G; Arrow Price/Stock: https://www.arrow.com/en/products/mmbt5401lt1g/on-semiconductor?region=nac
Q17 Q19 Q23-Q26 = MMBT5401LT1G: Transistor; pin to pad: 2>3 3>2; Manufacturer_Name: onsemi; Datasheet Link: http://www.onsemi.com/pub/Collateral/MMBT5401LT1-D.PDF; Height: 1.11mm; Manufacturer_Part_Number: MMBT5401LT1G; Mouser Part Number: 863-MMBT5401LT1G; Mouser Price/Stock: https://www.mouser.co.uk/ProductDetail/onsemi/MMBT5401LT1G?qs=R2UZ7gjkEjK19vIt05hkDw%3D%3D; Arrow Part Number: MMBT5401LT1G; Arrow Price/Stock: https://www.arrow.com/en/products/mmbt5401lt1g/on-semiconductor?region=nac
R12 R13 R17-R19 = CRCW08050000Z0EA: 100; 100k: *
R20-R22 = CRCW08050000Z0EA: 100k: *
R74 R76 R77 R79 R80 R82 R84-R86 R88-R90 R94 R95 = RC0805FR-07100KL
TP21 TP22 TP24-TP27 = TP_PCB?: Test_Point
VT11-VT21 = IPB60R600P6: Транзистор МОП, одиночный, N-канальный; pin to pad: D>2 G>1 S>3; ComponentDescription: =ComponentType+', '+ChannelType+', '+Comment+', '+Package; ChannelType: N-канальный; ComponentType: Транзистор МОП, одиночный; Package: TO-263-3
X1 = XT60-F: Разъем; ComponentDescription: Разъём, XT60-F; ComponentTypе: Разъём

## Sheet INV.SchDoc
size A1; SheetNumber: 5; SheetTotal: 5
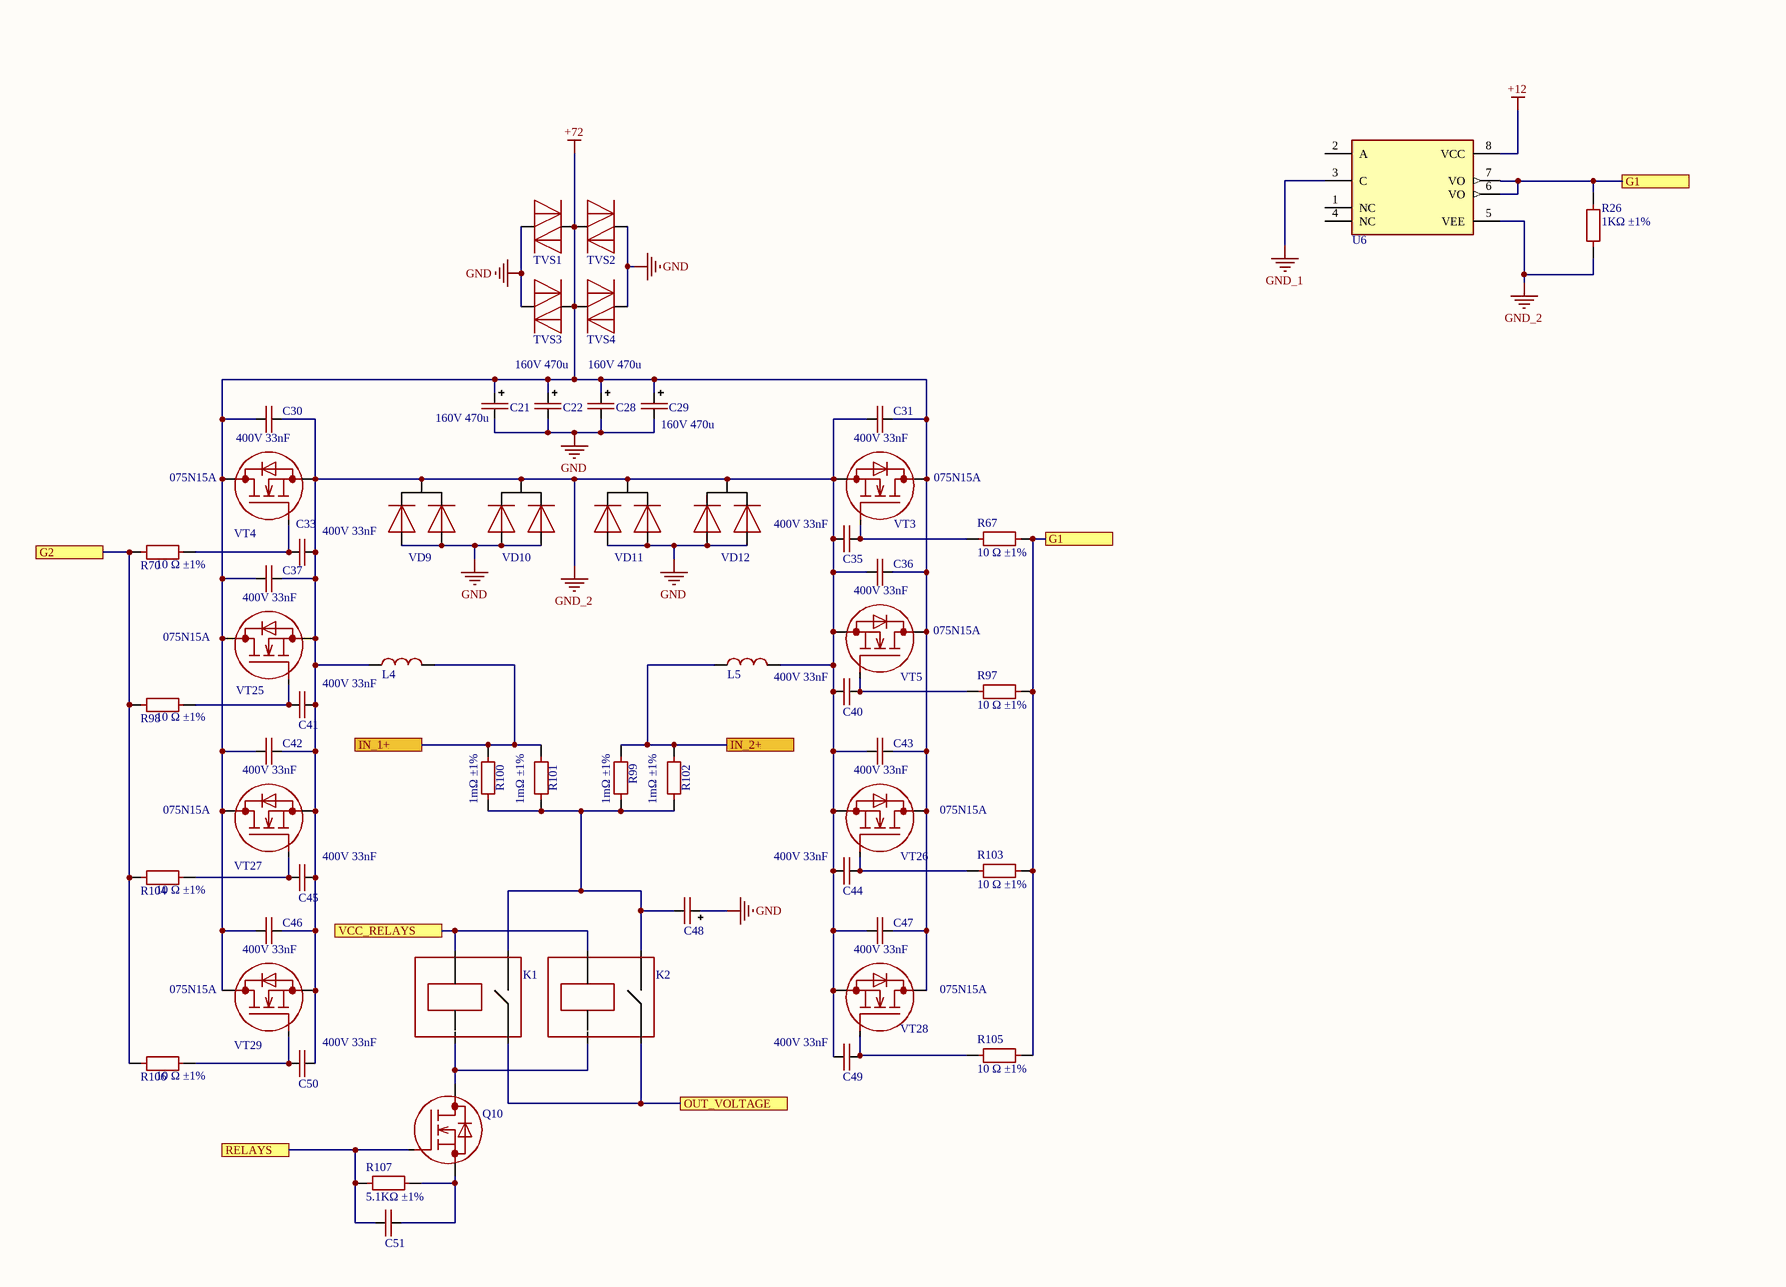
[diagram p7: INV.SchDoc, left]
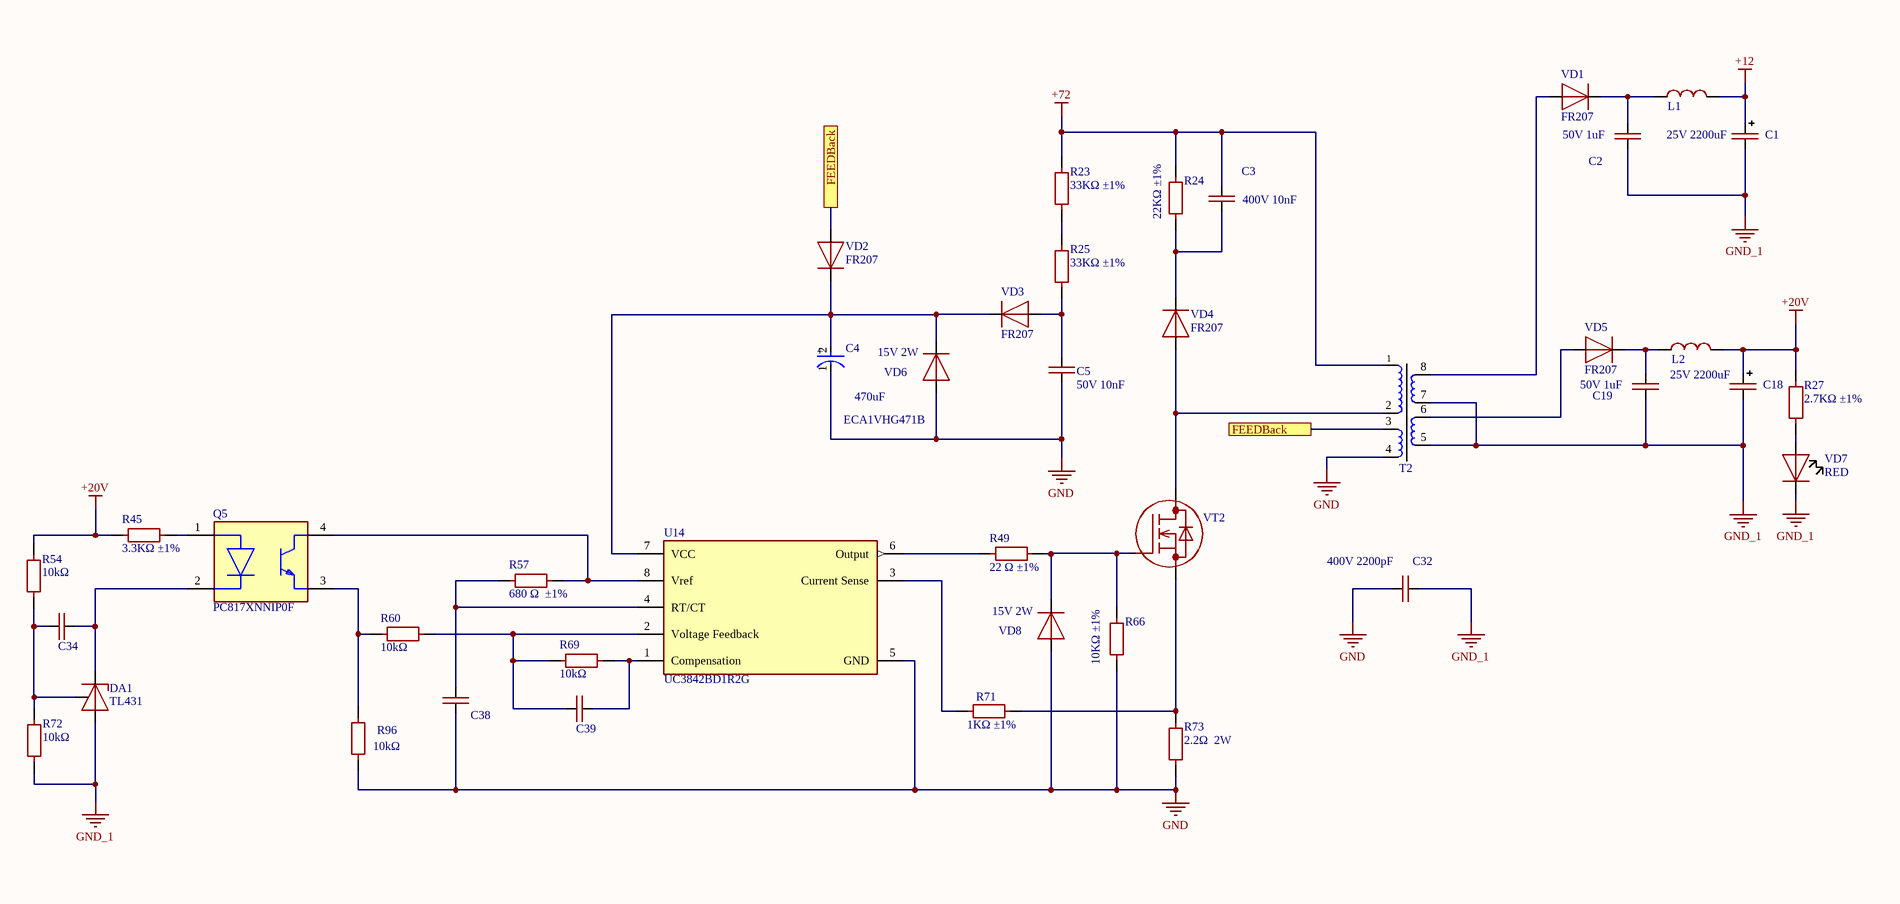
[diagram p8: INV.SchDoc, right]

### Parts
C1  value 25V 2200uF  [CAPPOL-12x25]  (hidden comment: CAP-POLAR)
C2  value 50V 1uF  [CAP-0603]  (hidden comment: CAP-NON-POLAR)
C3  value 400V 10nF  [CAP-V5]  (hidden comment: CAP-NON-POLAR)
C4  ECA1VHG471B  Capacitance: 470uF  [FP-RAD-TH-D_10_0_5-L_16_1-MFG]
C5  50V 10nF  [CAP-0805]
C18  value 25V 2200uF  [CAPPOL-12x25]  (hidden comment: CAP-POLAR)
C19  value 50V 1uF  [CAP-0603]  (hidden comment: CAP-NON-POLAR)
C21  value 160V 470u  [CAPPOL-18x40]  (hidden comment: CAP-POLAR)
C22  value 160V 470u  [CAPPOL-18x40]  (hidden comment: CAP-POLAR)
C28  value 160V 470u  [CAPPOL-18x40]  (hidden comment: CAP-POLAR)
C29  value 160V 470u  [CAPPOL-18x40]  (hidden comment: CAP-POLAR)
C30  value 400V 33nF  [CAP-1206]  (hidden comment: CAP-NON-POLAR)
C31  value 400V 33nF  [CAP-1206]  (hidden comment: CAP-NON-POLAR)
C32  value 400V 2200pF  [CAP-V5]  (hidden comment: CAP-NON-POLAR)
C33  value 400V 33nF  [CAP-1206]  (hidden comment: CAP-NON-POLAR)
C34  CAP-NON-POLAR  [KEMET_C0805C-DN_IPC_B]  (value not drawn)
C35  value 400V 33nF  [CAP-1206]  (hidden comment: CAP-NON-POLAR)
C36  value 400V 33nF  [CAP-1206]  (hidden comment: CAP-NON-POLAR)
C37  value 400V 33nF  [CAP-1206]  (hidden comment: CAP-NON-POLAR)
C38  CAP-NON-POLAR  [CAP-0603]  (value not drawn)
C39  CAP-NON-POLAR  [KEMET_C0805C-DN_IPC_B]  (value not drawn)
C40  value 400V 33nF  [CAP-1206]  (hidden comment: CAP-NON-POLAR)
C41  value 400V 33nF  [CAP-1206]  (hidden comment: CAP-NON-POLAR)
C42  value 400V 33nF  [CAP-1206]  (hidden comment: CAP-NON-POLAR)
C43  value 400V 33nF  [CAP-1206]  (hidden comment: CAP-NON-POLAR)
C44  value 400V 33nF  [CAP-1206]  (hidden comment: CAP-NON-POLAR)
C45  value 400V 33nF  [CAP-1206]  (hidden comment: CAP-NON-POLAR)
C46  value 400V 33nF  [CAP-1206]  (hidden comment: CAP-NON-POLAR)
C47  value 400V 33nF  [CAP-1206]  (hidden comment: CAP-NON-POLAR)
C48  CAP-POLAR  [CAP 330uF 450V]  (value not drawn)
C49  value 400V 33nF  [CAP-1206]  (hidden comment: CAP-NON-POLAR)
C50  value 400V 33nF  [CAP-1206]  (hidden comment: CAP-NON-POLAR)
C51  CAP-NON-POLAR  [CAP-0603]  (value not drawn)
DA1  TL431  [SOT23-3]
K1  RELAY  [HFV7-P]  (value not drawn)
K2  RELAY  [HFV7-P]  (value not drawn)
L1  IND-CONST  [IND-7850]  (value not drawn)
L2  IND-CONST  [IND-7850]  (value not drawn)
L4  IND-CONST  (value not drawn)
L5  IND-CONST  (value not drawn)
Q5  PC817XNNIP0F  [FP-PC817XNNIP0F-MFG]
Q10  MOSFET-N-GDS  [SOT-223-3]  (value not drawn)
R23  value 33KΩ ±1%  [RES-1206]  (hidden comment: RES-CONST)
R24  value 22KΩ ±1%  [RES-1206]  (hidden comment: RES-CONST)
R25  value 33KΩ ±1%  [RES-1206]  (hidden comment: RES-CONST)
R26  value 1KΩ ±1%  [RES-0603]  (hidden comment: RES-CONST)
R27  value 2.7KΩ ±1%  [RES-0603]  (hidden comment: RES-CONST)
R45  value 3.3KΩ ±1%  [Vishay_CRCW0805-e3_IPC_A]  (hidden comment: RES-CONST)
R49  value 22 Ω ±1%  [RES-0603]  (hidden comment: RES-CONST)
R54  10kΩ  [Vishay_CRCW0805-e3_IPC_A]
R57  value 680 Ω  ±1%  [RES-0603]  (hidden comment: RES-CONST)
R60  10kΩ  [Vishay_CRCW0805-e3_IPC_A]
R66  value 10KΩ ±1%  [RES-0603]  (hidden comment: RES-CONST)
R67  10 Ω ±1%  [RES-0603]
R69  10kΩ  [Vishay_CRCW0805-e3_IPC_A]
R70  10 Ω ±1%  [RES-0603]
R71  value 1KΩ ±1%  [RES-0603]  (hidden comment: RES-CONST)
R72  10kΩ  [Vishay_CRCW0805-e3_IPC_A]
R73  value 2.2Ω  2W  [RES-2W]  (hidden comment: RES-CONST)
R96  10kΩ  [RES-0603]
R97  10 Ω ±1%  [RES-0603]
R98  10 Ω ±1%  [RES-0603]
R99  value 1mΩ ±1%  [RES-3921]  (hidden comment: RES-CONST)
R100  value 1mΩ ±1%  [RES-3921]  (hidden comment: RES-CONST)
R101  value 1mΩ ±1%  [RES-3921]  (hidden comment: RES-CONST)
R102  value 1mΩ ±1%  [RES-3921]  (hidden comment: RES-CONST)
R103  10 Ω ±1%  [RES-0603]
R104  10 Ω ±1%  [RES-0603]
R105  10 Ω ±1%  [RES-0603]
R106  10 Ω ±1%  [RES-0603]
R107  value 5.1KΩ ±1%  [RES-0603]  (hidden comment: RES-CONST)
T2  TRANS_RM6  [TRANS_RM6]  (value not drawn)
TVS1  DIODE-3  [DO-214AB]  (value not drawn)
TVS2  DIODE-3  [DO-214AB]  (value not drawn)
TVS3  DIODE-3  [DO-214AB]  (value not drawn)
TVS4  DIODE-3  [DO-214AB]  (value not drawn)
U6  HCPL-3120  [SOP-8]  (value not drawn)
U14  UC3842BD1R2G  [FP-751-07-MFG]
VD1  FR207  [FR207]
VD2  FR207  [FR207]
VD3  FR207  [FR207]
VD4  FR207  [FR207]
VD5  FR207  [FR207]
VD6  value 15V 2W  [DO-35]  (hidden comment: DIODE)
VD7  value RED  [LED-0603]  (hidden comment: LED)
VD8  value 15V 2W  [DO-35]  (hidden comment: DIODE)
VD9  DIODE-2  [TO-247-3]  (value not drawn)
VD10  DIODE-2  [TO-247-3]  (value not drawn)
VD11  DIODE-2  [TO-247-3]  (value not drawn)
VD12  DIODE-2  [TO-247-3]  (value not drawn)
VT2  MOSFET-N-GDS  [TO-220(bend2)]  (value not drawn)
VT3  value 075N15A  [TO-220-3]  (hidden comment: MOSFET-N-GDS)
VT4  value 075N15A  [TO-220-3]  (hidden comment: MOSFET-N-GDS)
VT5  value 075N15A  [TO-220-3]  (hidden comment: MOSFET-N-GDS)
VT25  value 075N15A  [TO-220-3]  (hidden comment: MOSFET-N-GDS)
VT26  value 075N15A  [TO-220-3]  (hidden comment: MOSFET-N-GDS)
VT27  value 075N15A  [TO-220-3]  (hidden comment: MOSFET-N-GDS)
VT28  value 075N15A  [TO-220-3]  (hidden comment: MOSFET-N-GDS)
VT29  value 075N15A  [TO-220-3]  (hidden comment: MOSFET-N-GDS)

### Ports
FEEDBack, G1, G2, IN_1+, IN_2+, OUT_VOLTAGE, RELAYS, VCC_RELAYS

### Nets
+12: C1.1(+) L1.2 U6.8(VCC)
+20V: C18.1(+) L2.2 R27.2 R45.1 R54.1
+72: C3.2 C21.1(+) C22.1(+) C28.1(+) C29.1(+) C30.1 C31.2 C36.2 C37.1 C42.1 C43.2 C46.1 C47.2 R23.1 R24.2 T2.1 TVS1.2(A) TVS2.1(C) TVS3.2(A) TVS4.1(C) VT3.2(D) VT4.2(D) VT5.2(D) VT25.2(D) VT26.2(D) VT27.2(D) VT28.2(D) VT29.2(D)
GND: C4.1(C) C5.2 C21.2(-) C22.2(-) C28.2(-) C29.2(-) C32.2 C38.1 C48.1(+) R66.1 R73.1 R96.1 T2.4 TVS1.1(C) TVS2.2(A) TVS3.1(C) TVS4.2(A) U14.5(GND) VD6.2(A) VD8.2(A) VD9.1(A) VD9.3(A) VD10.1(A) VD10.3(A) VD11.1(A) VD11.3(A) VD12.1(A) VD12.3(A)
GND_1: C1.2(-) C2.1 C18.2(-) C19.1 C32.1 DA1.3(A) R72.2 T2.5 T2.7 U6.3(C) VD7.1(C)
GND_2: C30.2 C31.1 C33.2 C35.1 C36.1 C37.2 C40.1 C41.2 C42.2 C43.1 C44.1 C45.2 C46.2 C47.1 C49.1 C50.2 L4.1 L5.1 R26.1 U6.5(VEE) VD9.2(C) VD10.2(C) VD11.2(C) VD12.2(C) VT3.3(S) VT4.3(S) VT5.3(S) VT25.3(S) VT26.3(S) VT27.3(S) VT28.3(S) VT29.3(S)
NetC2_2: C2.2 L1.1 VD1.1(C)
NetC3_1: C3.1 R24.1 VD4.1(C)
NetC4_2: C4.2(A) U14.7(VCC) VD2.1(C) VD3.1(C) VD6.1(C)
NetC5_1: C5.1 R25.2 VD3.2(A)
NetC19_2: C19.2 L2.1 VD5.1(C)
NetC33_1: C33.1 R70.2 VT4.1(G)
NetC34_1: C34.1 DA1.2(C) Q5.2(C)
NetC34_2: C34.2 DA1.1(REF) R54.2 R72.1
NetC35_2: C35.2 R67.2 VT3.1(G)
NetC38_2: C38.2 R57.2 U14.4(RT/CT)
NetC39_1: C39.1 R69.1 U14.1(Compensation)
NetC39_2: C39.2 R60.1 R69.2 U14.2(Voltage_Feedback)
NetC40_2: C40.2 R97.2 VT5.1(G)
NetC41_1: C41.1 R98.2 VT25.1(G)
NetC44_2: C44.2 R103.2 VT26.1(G)
NetC45_1: C45.1 R104.2 VT27.1(G)
NetC48_2: C48.2(-) K1.86 K2.86 R99.1 R100.1 R101.1 R102.1
NetC49_2: C49.2 R105.2 VT28.1(G)
NetC50_1: C50.1 R106.2 VT29.1(G)
NetC51_1: C51.1 Q10.1(G) R107.1 ; port RELAYS
NetC51_2: C51.2 Q10.3(S) R107.2
NetK1_30: K1.30 K2.30 Q10.2(D)
NetK1_85: K1.85 K2.85 ; port OUT_VOLTAGE
NetK1_87: K1.87 K2.87 ; port VCC_RELAYS
NetL4_2: L4.2 R100.2 R101.2 ; port IN_1+
NetL5_2: L5.2 R99.2 R102.2 ; port IN_2+
NetQ5_1: Q5.1(A) R45.2
NetQ5_3: Q5.3(E) R60.2 R96.2
NetQ5_4: Q5.4(C) R57.1 U14.8(Vref)
NetR23_2: R23.2 R25.1
NetR26_2: R26.2 R67.1 R97.1 R103.1 R105.1 U6.6(VO) U6.7(VO) ; port G1
NetR27_1: R27.1 VD7.2(A)
NetR49_1: R49.1 U14.6(Output)
NetR49_2: R49.2 R66.2 VD8.1(C) VT2.1(G)
NetR70_1: R70.1 R98.1 R104.1 R106.1 ; port G2
NetR71_1: R71.1 U14.3(Current_Sense)
NetR71_2: R71.2 R73.2 VT2.3(S)
NetT2_2: T2.2 VD4.2(A) VT2.2(D)
NetT2_3: T2.3 VD2.2(A) ; port FEEDBack
NetT2_6: T2.6 VD5.2(A)
NetT2_8: T2.8 VD1.2(A)

Not connected (* = marked no-connect by the designer): U6 1(NC) 2(A) 4(NC)

### Notes on the sheet
- (in symbol CMP-05427-001499-1) +

### Library data of the parts
C1 C18 = 16: Part Number: 16; №: 16
C2 C19 = 2: Part Number: 2; №: 2
C3 C32 = 6: Part Number: 6; №: 6
C4 = CMP-05427-001499-1: Aluminum Electrolytic Capacitors (Radial Lead Type) AEC-Q200 Qualified 470uF ±20% 35V; Lead Diameter: 0.6mm; Lead/Base Style: Straight; Polarity: Polar; Life (Hours): 2000Hour; Ripple Current: 460mA; Tolerance: 20%; Termination: Radial; Contact Plating: Tin; Length: 16mm; Voltage Rating: 35V; Max Operating Temperature: 105°C; Construction: RADIAL; Voltage Rating (DC): 35V; Radiation Hardening: No; Packaging: Tape and Reel; Diameter: 10mm; Series: NHG; Case/Package: Radial; Mount: Through Hole; Lead Pitch: 5mm; Height: 16mm; RoHS Compliant: Yes; Height - Seated (Max): 0.669inch; Min Operating Temperature: -55°C; Package Quantity: 500
C5 = 17: Part Number: 17; Value: 50V 100nF; №: 17
C21 C22 C28 C29 = 1: №: 1; ID: C-0690; Part Number: 1
C30 C31 C33 C35-C37 C40-C47 C49-C51 = 5: Part Number: 5; ID: C-0694; №: 5
C34 C39 = CAP-NON-POLAR: Part Number: 2; Value: 50V 100nF; №: 2
C38 = 2: Part Number: 2; Value: 50V 100nF; №: 2
C48 = 12: Part Number: 12; Value: 80V 470uF; №: 12
DA1 = TL431: №: 9; ID: I-0009; Part Number: TL431; Value: TL431
K1 K2 = HFV7-P: №: 1; ID: E-0001; Value: 12VDC 70A; Part Number: HFV7-P
L1 L2 = 2: Part Number: 2; ID: L-0002; Value: 33; №: 2
L4 L5 = 1: №: 1; ID: L-0001; Part Number: 1
Q5 = CMP-65434-000005-1: OPTOISOLATOR 5KV TRANS 4SMD; Reverse Breakdown Voltage: 6V; Output Current per Channel: 30mA; Power Dissipation: 200mW; Collector-emitter Voltage-Max: 200mV; Max Output Voltage: 80V; Input Current: 50mA; Forward Voltage: 1.4V; Fall Time: 18000ns; Number of Elements: 1; Input Type: DC; Packaging: Tape and Reel; RoHS Compliant: Yes; Contact Plating: Copper; Min Operating Temperature: -30°C; Collector Emitter Saturation Voltage: 200mV; Max Input Current: 50mA; Radiation Hardening: No; Max Collector Current: 50mA; Case/Package: SMD/SMT; Mount: Surface Mount; Output Voltage: 80V; Forward Current: 50mA; Max Power Dissipation: 200mW; Collector Emitter Voltage (VCEO): 80V; Number of Channels: 1; Rise Time: 18000ns; Isolation Voltage: 5kV; Number of Pins: 4; Lead Free: Lead Free; Package Quantity: 2000; Isolation Voltage-Max: 5kV; Max Operating Temperature: 100°C
Q10 = AP9997GK: №: 4; ID: T-0004; Value: 100V 3.2A; Part Number: AP9997GK
R23 R25 = 206: Part Number: 206; ID: R-0206; №: 206
R24 = 207: Part Number: 207; ID: R-0207; №: 207
R26 R71 = 37: Part Number: 37; ID: R-0037; №: 37
R27 = 39: Part Number: 39; ID: R-0039; №: 39
R45 = RES-CONST: Part Number: 40; ID: R-0040; №: 40
R49 = 2: Part Number: 2; ID: R-0002; №: 2
R54 R60 R69 R72 R96 = RES-CONST: Part Number: 22; ID: R-0022; №: 22
R57 = 33: Part Number: 33; ID: R-0033; №: 33
R66 = 50: Part Number: 50; ID: R-0050; №: 50
R67 R70 R97 R98 R103-R106 = 1: №: 1; ID: R-0001; Part Number: 1; Value: 10 Ω ±1%
R73 = 205: Part Number: 205; ID: R-0205; №: 205
R99-R102 = PU3921FKMP90R001L: №: 199; ID: R-0199; Part Number: PU3921FKMP90R001L
R107 = 43: Part Number: 43; ID: R-0043; №: 43
T2 = 4: №: 4; Value: XX; Part Number: 4
TVS1-TVS4 = SMCJ150CA: №: 2; ID: D-0002; Value: TVS 200v; Part Number: SMCJ150CA
U14 = CMP-00278-00875370-1: UC3842BD1R2G UC3842B Series 30 V 275 kHz High Performance Current Mode Controller - SOIC-8; NexarPartId: 875370; Manufacturer Lifecycle Status: ACTIVE; Max Power Dissipation: 702mW; Max Supply Current: 17mA; Number of Channels: 1; Switching Frequency: 52kHz; Max Supply Voltage: 30V; Max Junction Temperature (Tj): 150°C; Max Duty Cycle: 96%; Output Current: 1A; Rise Time: 50ns; Output Voltage: 5.1V; Max Frequency: 275kHz; Topology: Flyback, Boost; Packaging: Cut Tape (CT); Max Operating Temperature: 70°C; Lifecycle Status: Production; Length: 5mm; Case/Package: SOIC; Schedule B: 8542390000, 8542390000; Number of Pins: 8; RoHS: Compliant; Frequency: 52kHz; Number of Outputs: 1; Width: 4mm; Halogen Free: Halogen Free; Height: 1.5mm; Radiation Hardening: No; Ambient Temperature Range High: 70°C; Duty Cycle: 96%; Lead Free: Lead Free; Min Operating Temperature: 0°C; Mount: Surface Mount; Fall Time: 50ns
VD1-VD5 = FR207: №: 12; ID: D-0754; Value: 1000V 2A; Part Number: FR207
VD6 VD8 = BZX55C15V: №: 13; ID: D-0755; Part Number: BZX55C15V
VD7 = 2: Part Number: 2; ID: O-0002; №: 2
VD9-VD12 = 80CPU02: №: 1; ID: D-0743; Value: 200V 40A; Part Number: 80CPU02
VT2 = IRF640_: №: 8; ID: T-0008; Value: 200V 18A; Part Number: IRF640_
VT3-VT5 VT25-VT29 = 075N15A: №: 1; ID: T-0001; Part Number: 075N15A

## Nets that join several sheets
GND: Logger (44 pins), INV (28 pins)